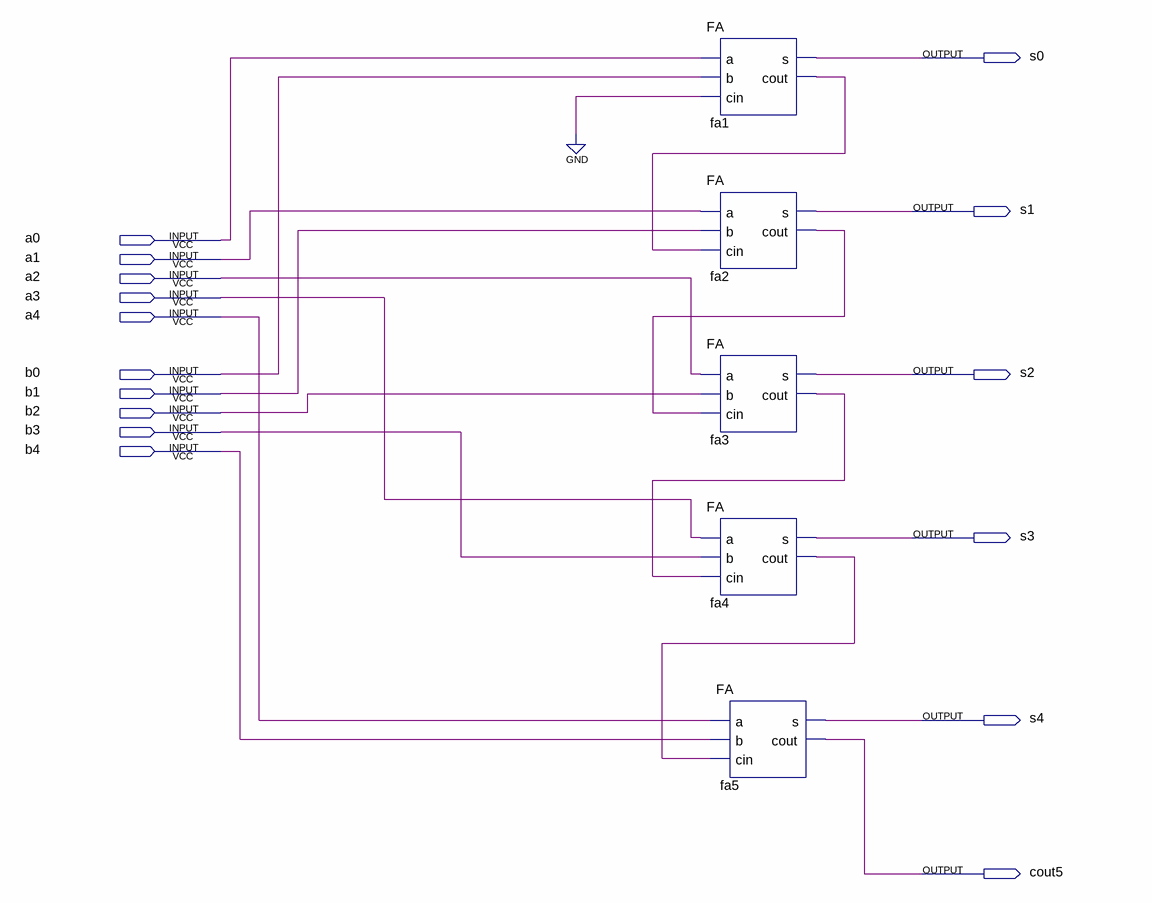
[diagram p0: schematic sheet]
// Quartus schematic 5bitadder.bdf as structural Verilog: 5 symbols, 16 pins
module \5bitadder  (
  input  a0,
  input  a1,
  input  a2,
  input  a3,
  input  a4,
  input  b0,
  input  b1,
  input  b2,
  input  b3,
  input  b4,
  output s0,
  output s1,
  output s2,
  output s3,
  output s4,
  output cout5
);

  wire fa1_cout, fa2_cout, fa3_cout, fa4_cout;

  FA fa1 (.a(a0), .b(b0), .cin(1'b0), .s(s0), .cout(fa1_cout));
  FA fa2 (.a(a1), .b(b1), .cin(fa1_cout), .s(s1), .cout(fa2_cout));
  FA fa3 (.a(a2), .b(b2), .cin(fa2_cout), .s(s2), .cout(fa3_cout));
  FA fa4 (.a(a3), .b(b3), .cin(fa3_cout), .s(s3), .cout(fa4_cout));
  FA fa5 (.a(a4), .b(b4), .cin(fa4_cout), .s(s4), .cout(cout5));
endmodule
